# EasyEDA schematic stepper_control_board.json
TITLE: Sheet_1; REV: 1.0; Date: 2024-02-19; Sheet: 1/1; Drawn By: Gabriel Thien; Company: Your Company
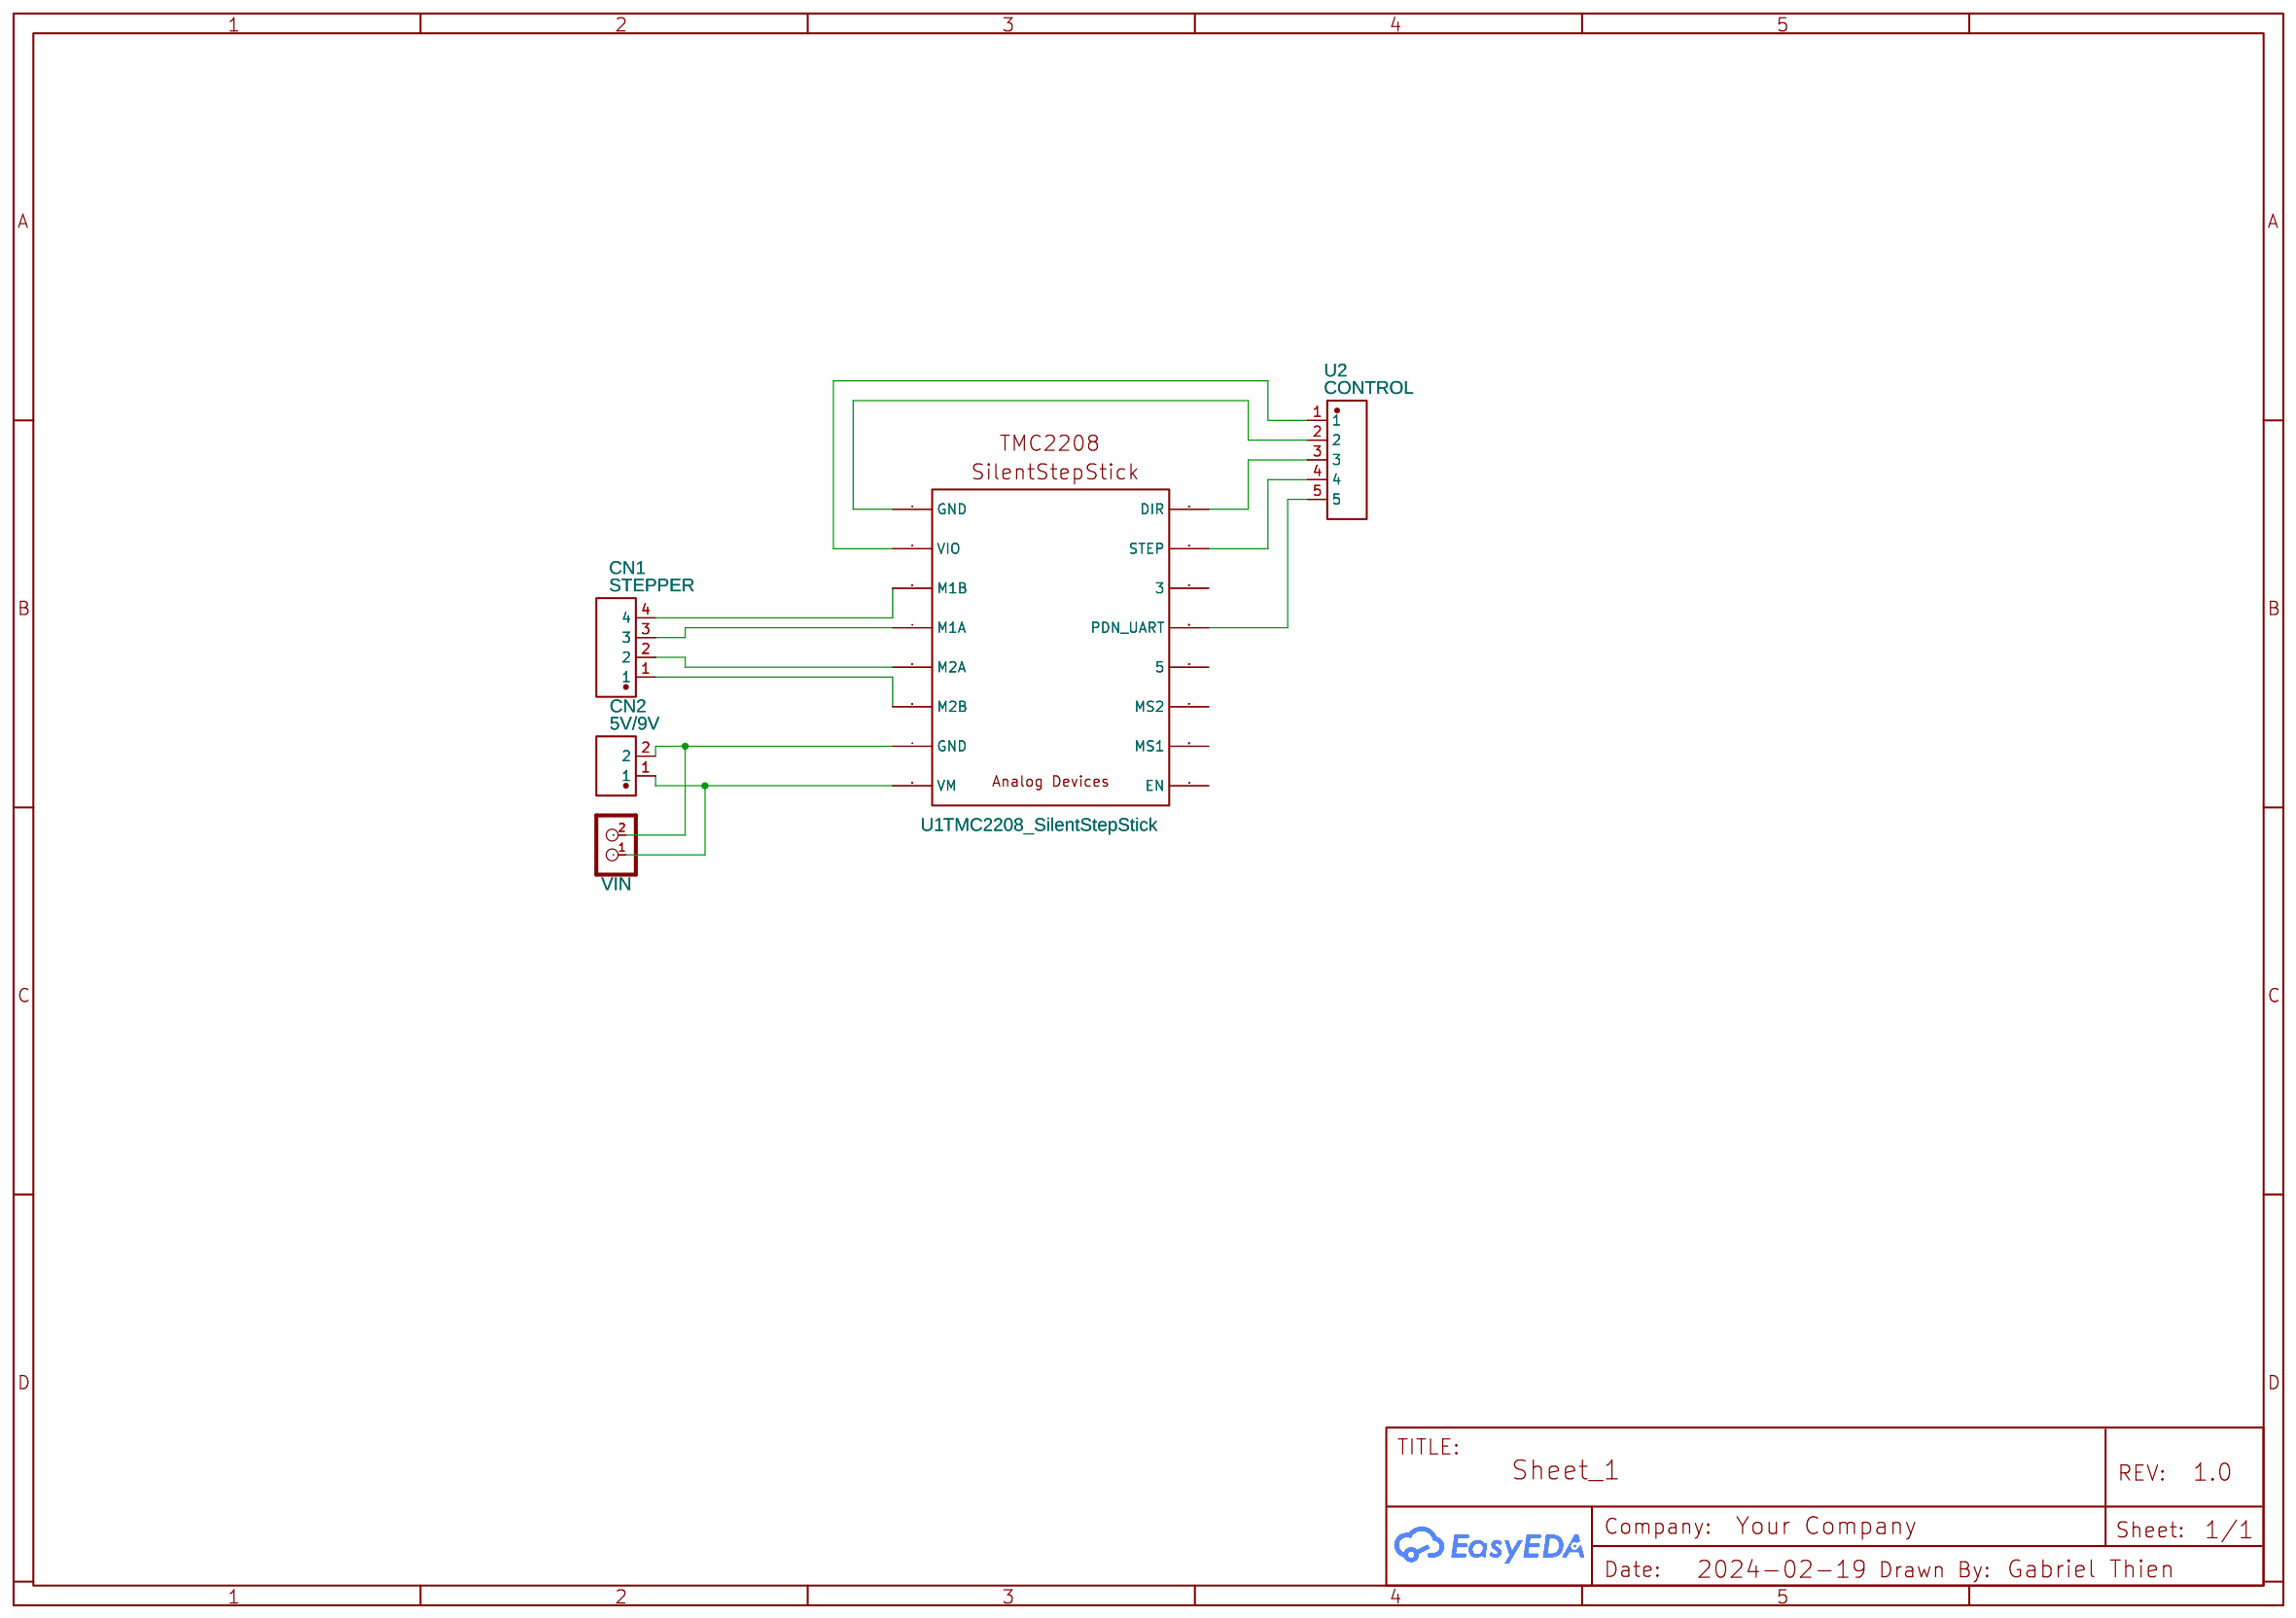
[diagram p0: schematic sheet]

## Parts
CN1  STEPPER  [CONN-TH_XH-4A]
CN2  5V/9V  [CONN-TH_XH-2A]
U1  TMC2208_SilentStepStick
U2  CONTROL  [CONN-TH_XH-5A]
VIN  BT  [TERMINAL_BLOCK_2P_5]

## Library data of the parts
CN1 = XH4X2.54V: Contributor: lcsc; Supplier: LCSC; Supplier Part: C9900021957; Manufacturer: null; Manufacturer Part: XH4x2.54V; JLCPCB Part Class: Extended Part
CN2 = XH-D-2A: Contributor: lcsc; Supplier: LCSC; Supplier Part: C5160911; Manufacturer: DEALON(德艺隆); JLCPCB Part Class: Extended Part
U1 = TMC2208_SilentStepStick: Supplier: AnalogDevices; Contributor: Gabriel Thien
U2 = XD-XH-5A-G: Supplier: LCSC; Supplier Part: C17700949; Manufacturer: XUNDA(讯答); Contributor: lcsc
VIN = CON_TERMINAL_BLOCK_02-5MM: 2 poles wire to board terminal block; Contributor: DangerousPrototype

## Nets
Net-(CN1-1): CN1.1 U1.6(M2B)
Net-(CN1-2): CN1.2 U1.5(M2A)
Net-(CN1-3): CN1.3 U1.4(M1A)
Net-(CN1-4): CN1.4 U1.3(M1B)
Net-(CN2-1): CN2.1 U1.8(VM) VIN.1
Net-(CN2-2): CN2.2 U1.7(GND) VIN.2
Net-(U1-1): U1.1(GND) U2.2
Net-(U1-2): U1.2(VIO) U2.1
Net-(U1-13): U1.13(PDN_UART) U2.5
Net-(U1-15): U1.15(STEP) U2.4
Net-(U1-16): U1.16(DIR) U2.3

Not connected (* = marked no-connect by the designer): U1 9(EN) 10(MS1) 11(MS2) 12(5) 14(3)
